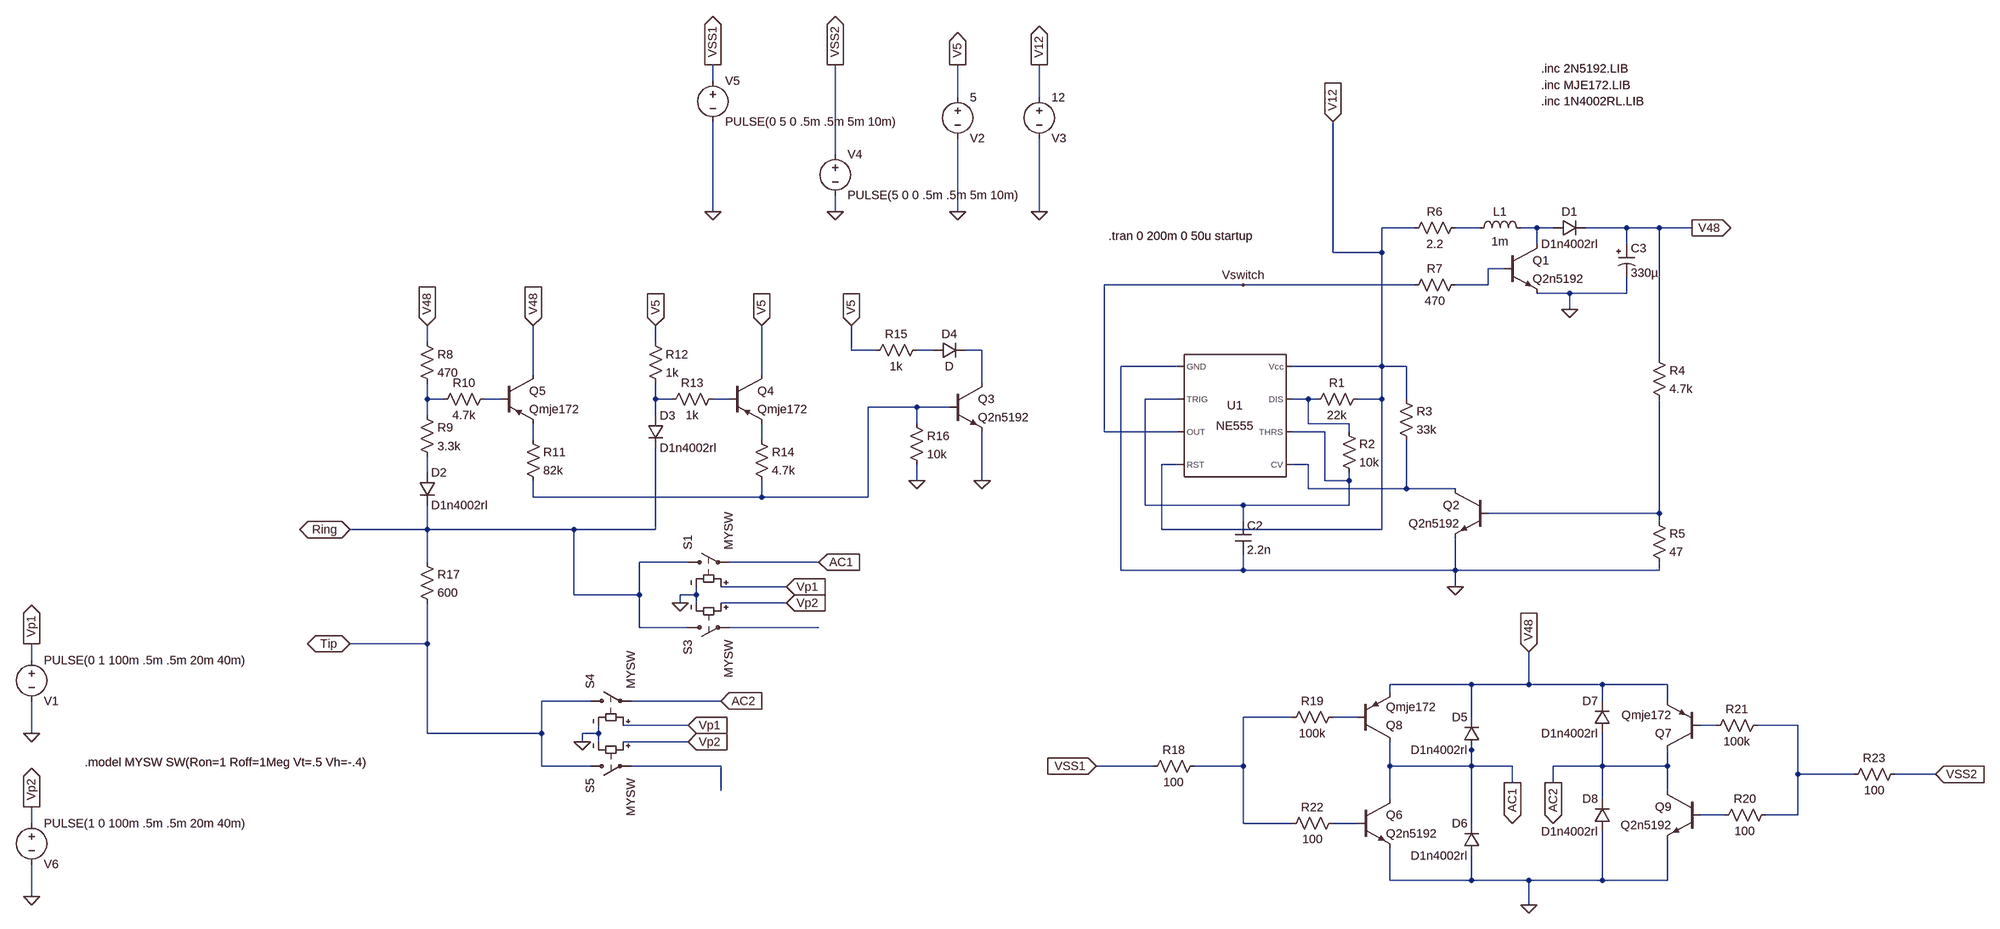
[diagram p0: schematic phone.asc]
phone.asc, the LTspice schematic file:
Version 4
SHEET 1 888 1604
WIRE -1776 -288 -1776 -320
WIRE -1296 -256 -1296 -320
WIRE -1136 -256 -1136 -320
WIRE -1536 -144 -1536 -320
WIRE -1776 -32 -1776 -208
WIRE -1536 -32 -1536 -64
WIRE -1296 -32 -1296 -176
WIRE -1136 -32 -1136 -176
WIRE -400 0 -464 0
WIRE -272 0 -320 0
WIRE -160 0 -192 0
WIRE -128 0 -160 0
WIRE 16 0 -64 0
WIRE 80 0 16 0
WIRE 144 0 80 0
WIRE -160 32 -160 0
WIRE 16 32 16 0
WIRE -560 48 -560 -208
WIRE -464 48 -464 0
WIRE -464 48 -560 48
WIRE -224 80 -256 80
WIRE -736 112 -1008 112
WIRE -400 112 -736 112
WIRE -256 112 -256 80
WIRE -256 112 -320 112
WIRE -96 128 -160 128
WIRE 16 128 16 96
WIRE 16 128 -96 128
WIRE -96 160 -96 128
WIRE -2336 224 -2336 192
WIRE -1888 224 -1888 192
WIRE -1504 240 -1504 192
WIRE -1456 240 -1504 240
WIRE -1344 240 -1376 240
WIRE -1248 240 -1280 240
WIRE 80 256 80 0
WIRE -864 272 -976 272
WIRE -464 272 -464 48
WIRE -464 272 -640 272
WIRE -416 272 -464 272
WIRE -2128 288 -2128 192
WIRE -1680 288 -1680 192
WIRE -1248 304 -1248 240
WIRE -2336 336 -2336 304
WIRE -2304 336 -2336 336
WIRE -2192 336 -2224 336
WIRE -1888 336 -1888 304
WIRE -1856 336 -1888 336
WIRE -1744 336 -1776 336
WIRE -864 336 -928 336
WIRE -608 336 -640 336
WIRE -592 336 -608 336
WIRE -464 336 -464 272
WIRE -464 336 -512 336
WIRE -416 336 -416 272
WIRE -1376 352 -1472 352
WIRE -1312 352 -1376 352
WIRE -2336 368 -2336 336
WIRE -1888 368 -1888 336
WIRE -1376 384 -1376 352
WIRE -608 384 -608 336
WIRE -528 384 -608 384
WIRE -1008 400 -1008 112
WIRE -864 400 -1008 400
WIRE -576 400 -640 400
WIRE -528 400 -528 384
WIRE -2128 416 -2128 384
WIRE -1680 416 -1680 384
WIRE -864 464 -896 464
WIRE -608 464 -640 464
WIRE -2336 480 -2336 448
WIRE -1376 496 -1376 464
WIRE -1248 496 -1248 400
WIRE -576 496 -576 400
WIRE -528 496 -528 480
WIRE -528 496 -576 496
WIRE -608 512 -608 464
WIRE -416 512 -416 416
WIRE -416 512 -608 512
WIRE -320 512 -416 512
WIRE -2128 528 -2128 496
WIRE -1680 528 -1680 496
WIRE -1680 528 -2128 528
WIRE -1472 528 -1472 352
WIRE -1472 528 -1680 528
WIRE -928 544 -928 336
WIRE -736 544 -928 544
WIRE -528 544 -528 496
WIRE -528 544 -736 544
WIRE 80 560 80 336
WIRE 80 560 -256 560
WIRE -736 576 -736 544
WIRE 80 576 80 560
WIRE -2336 592 -2336 544
WIRE -2336 592 -2576 592
WIRE -2048 592 -2336 592
WIRE -1888 592 -1888 432
WIRE -1888 592 -2048 592
WIRE -896 592 -896 464
WIRE -464 592 -464 336
WIRE -464 592 -896 592
WIRE -2336 656 -2336 592
WIRE -1824 656 -1920 656
WIRE -1568 656 -1744 656
WIRE -976 672 -976 272
WIRE -736 672 -736 640
WIRE -736 672 -976 672
WIRE -320 672 -320 608
WIRE -320 672 -736 672
WIRE 80 672 80 656
WIRE 80 672 -320 672
WIRE -1632 704 -1760 704
WIRE -320 704 -320 672
WIRE -2048 720 -2048 592
WIRE -1920 720 -1920 656
WIRE -1920 720 -2048 720
WIRE -1808 720 -1808 704
WIRE -1808 720 -1840 720
WIRE -1840 736 -1840 720
WIRE -1808 736 -1808 720
WIRE -1632 736 -1760 736
WIRE -1920 784 -1920 720
WIRE -1824 784 -1920 784
WIRE -1568 784 -1744 784
WIRE -2336 816 -2336 736
WIRE -2336 816 -2576 816
WIRE -3200 848 -3200 816
WIRE -288 896 -448 896
WIRE -176 896 -176 832
WIRE -176 896 -288 896
WIRE -32 896 -176 896
WIRE 96 896 -32 896
WIRE -448 912 -448 896
WIRE -2016 928 -2112 928
WIRE -1760 928 -1936 928
WIRE -32 928 -32 896
WIRE 96 928 96 896
WIRE -640 960 -736 960
WIRE -512 960 -560 960
WIRE -288 960 -288 896
WIRE -1824 976 -1952 976
WIRE 192 976 160 976
WIRE 352 976 272 976
WIRE -3200 992 -3200 928
WIRE -2336 992 -2336 816
WIRE -2112 992 -2112 928
WIRE -2112 992 -2336 992
WIRE -2000 992 -2000 976
WIRE -2000 992 -2032 992
WIRE -2032 1008 -2032 992
WIRE -2000 1008 -2000 992
WIRE -1824 1008 -1952 1008
WIRE -288 1024 -288 1008
WIRE -2112 1056 -2112 992
WIRE -2016 1056 -2112 1056
WIRE -1760 1056 -1936 1056
WIRE -912 1056 -1024 1056
WIRE -736 1056 -736 960
WIRE -736 1056 -832 1056
WIRE -448 1056 -448 1008
WIRE -288 1056 -288 1024
WIRE -288 1056 -448 1056
WIRE -208 1056 -288 1056
WIRE -32 1056 -32 992
WIRE -32 1056 -128 1056
WIRE 96 1056 96 1024
WIRE 96 1056 -32 1056
WIRE 352 1072 352 976
WIRE 480 1072 352 1072
WIRE 640 1072 560 1072
WIRE -208 1088 -208 1056
WIRE -128 1088 -128 1056
WIRE -1760 1104 -1760 1056
WIRE 96 1104 96 1056
WIRE -448 1120 -448 1056
WIRE -32 1120 -32 1056
WIRE 208 1152 160 1152
WIRE 352 1152 352 1072
WIRE 352 1152 288 1152
WIRE -3200 1168 -3200 1136
WIRE -736 1168 -736 1056
WIRE -640 1168 -736 1168
WIRE -512 1168 -560 1168
WIRE -288 1168 -288 1056
WIRE -448 1280 -448 1216
WIRE -288 1280 -288 1232
WIRE -288 1280 -448 1280
WIRE -176 1280 -288 1280
WIRE -32 1280 -32 1184
WIRE -32 1280 -176 1280
WIRE 96 1280 96 1200
WIRE 96 1280 -32 1280
WIRE -3200 1312 -3200 1248
WIRE -176 1328 -176 1280
FLAG -320 704 0
FLAG 144 0 V48
IOPIN 144 0 Out
FLAG -96 160 0
FLAG -736 112 Vswitch
FLAG -2128 192 V48
IOPIN -2128 192 In
FLAG -2336 192 V48
IOPIN -2336 192 In
FLAG -1888 192 V5
IOPIN -1888 192 In
FLAG -1680 192 V5
IOPIN -1680 192 In
FLAG -1504 192 V5
IOPIN -1504 192 In
FLAG -1376 496 0
FLAG -1248 496 0
FLAG -560 -208 V12
IOPIN -560 -208 In
FLAG -1136 -32 0
FLAG -1296 -32 0
FLAG -1296 -320 V5
IOPIN -1296 -320 Out
FLAG -1136 -320 V12
IOPIN -1136 -320 Out
FLAG -3200 992 0
FLAG -1536 -32 0
FLAG -1536 -320 VSS2
IOPIN -1536 -320 Out
FLAG -1776 -32 0
FLAG -1776 -320 VSS1
IOPIN -1776 -320 Out
FLAG -176 1328 0
FLAG -176 832 V48
IOPIN -176 832 In
FLAG -3200 816 Vp1
IOPIN -3200 816 Out
FLAG -208 1088 AC1
IOPIN -208 1088 Out
FLAG -128 1088 AC2
IOPIN -128 1088 Out
FLAG -1568 656 AC1
IOPIN -1568 656 In
FLAG -1760 928 AC2
IOPIN -1760 928 In
FLAG -1024 1056 VSS1
IOPIN -1024 1056 In
FLAG 640 1072 VSS2
IOPIN 640 1072 In
FLAG -2576 592 Ring
IOPIN -2576 592 BiDir
FLAG -2576 816 Tip
IOPIN -2576 816 BiDir
FLAG -1840 736 0
FLAG -1632 704 Vp1
IOPIN -1632 704 In
FLAG -2032 1008 0
FLAG -3200 1312 0
FLAG -3200 1136 Vp2
IOPIN -3200 1136 Out
FLAG -1632 736 Vp2
IOPIN -1632 736 In
FLAG -1824 976 Vp1
IOPIN -1824 976 In
FLAG -1824 1008 Vp2
IOPIN -1824 1008 In
SYMBOL Misc\\NE555 -752 368 R0
SYMATTR InstName U1
SYMBOL res -608 352 R270
WINDOW 0 32 56 VTop 2
WINDOW 3 0 56 VBottom 2
SYMATTR InstName R1
SYMATTR Value 22k
SYMBOL res -544 384 R0
SYMATTR InstName R2
SYMATTR Value 10k
SYMBOL res -432 320 R0
SYMATTR InstName R3
SYMATTR Value 33k
SYMBOL res 64 240 R0
SYMATTR InstName R4
SYMATTR Value 4.7k
SYMBOL res 64 560 R0
SYMATTR InstName R5
SYMATTR Value 47
SYMBOL res -416 16 R270
WINDOW 0 32 56 VTop 2
WINDOW 3 0 56 VBottom 2
SYMATTR InstName R6
SYMATTR Value 2.2
SYMBOL res -416 128 R270
WINDOW 0 32 56 VTop 2
WINDOW 3 0 56 VBottom 2
SYMATTR InstName R7
SYMATTR Value 470
SYMBOL npn -224 32 R0
SYMATTR InstName Q1
SYMATTR Value Q2n5192
SYMBOL npn -256 512 M0
SYMATTR InstName Q2
SYMATTR Value Q2n5192
SYMBOL cap -752 576 R0
SYMATTR InstName C2
SYMATTR Value 2.2n
SYMBOL diode -128 16 R270
WINDOW 0 32 32 VTop 2
WINDOW 3 0 32 VBottom 2
SYMATTR InstName D1
SYMATTR Value D1n4002rl
SYMBOL ind -288 16 R270
WINDOW 0 32 56 VTop 2
WINDOW 3 5 56 VBottom 2
SYMATTR InstName L1
SYMATTR Value 1m
SYMBOL res -2352 208 R0
SYMATTR InstName R8
SYMATTR Value 470
SYMBOL res -2352 352 R0
SYMATTR InstName R9
SYMATTR Value 3.3k
SYMBOL res -2208 320 R90
WINDOW 0 0 56 VBottom 2
WINDOW 3 32 56 VTop 2
SYMATTR InstName R10
SYMATTR Value 4.7k
SYMBOL res -2144 400 R0
SYMATTR InstName R11
SYMATTR Value 82k
SYMBOL res -1904 208 R0
SYMATTR InstName R12
SYMATTR Value 1k
SYMBOL res -1760 320 R90
WINDOW 0 0 56 VBottom 2
WINDOW 3 32 56 VTop 2
SYMATTR InstName R13
SYMATTR Value 1k
SYMBOL res -1696 400 R0
SYMATTR InstName R14
SYMATTR Value 4.7k
SYMBOL res -1360 224 R90
WINDOW 0 0 56 VBottom 2
WINDOW 3 32 56 VTop 2
SYMATTR InstName R15
SYMATTR Value 1k
SYMBOL res -1392 368 R0
SYMATTR InstName R16
SYMATTR Value 10k
SYMBOL npn -1312 304 R0
SYMATTR InstName Q3
SYMATTR Value Q2n5192
SYMBOL pnp -1744 288 R0
SYMATTR InstName Q4
SYMATTR Value Qmje172
SYMBOL pnp -2192 288 R0
SYMATTR InstName Q5
SYMATTR Value Qmje172
SYMBOL diode -2352 480 R0
SYMATTR InstName D2
SYMATTR Value D1n4002rl
SYMBOL diode -1904 368 R0
SYMATTR InstName D3
SYMATTR Value D1n4002rl
SYMBOL diode -1344 256 R270
WINDOW 0 32 32 VTop 2
WINDOW 3 0 32 VBottom 2
SYMATTR InstName D4
SYMBOL voltage -1296 -272 R0
WINDOW 0 24 96 Left 2
WINDOW 3 24 16 Left 2
WINDOW 123 0 0 Left 2
WINDOW 39 0 0 Left 2
SYMATTR InstName V2
SYMATTR Value 5
SYMBOL voltage -1136 -272 R0
WINDOW 0 24 96 Left 2
WINDOW 3 24 16 Left 2
WINDOW 123 0 0 Left 2
WINDOW 39 0 0 Left 2
SYMATTR InstName V3
SYMATTR Value 12
SYMBOL res -2352 640 R0
SYMATTR InstName R17
SYMATTR Value 600
SYMBOL voltage -3200 832 R0
WINDOW 0 24 96 Left 2
WINDOW 3 24 16 Left 2
WINDOW 123 0 0 Left 2
WINDOW 39 0 0 Left 2
SYMATTR InstName V1
SYMATTR Value PULSE(0 1 100m .5m .5m 20m 40m)
SYMBOL voltage -1536 -160 R0
WINDOW 123 0 0 Left 0
WINDOW 39 0 0 Left 0
SYMATTR InstName V4
SYMATTR Value PULSE(5 0 0 .5m .5m 5m 10m)
SYMBOL voltage -1776 -304 R0
WINDOW 123 0 0 Left 0
WINDOW 39 0 0 Left 0
SYMATTR InstName V5
SYMATTR Value PULSE(0 5 0 .5m .5m 5m 10m)
SYMBOL diode -272 1024 R180
WINDOW 0 24 64 Left 2
WINDOW 3 24 0 Left 2
SYMATTR InstName D5
SYMATTR Value D1n4002rl
SYMBOL diode -272 1232 R180
WINDOW 0 24 64 Left 2
WINDOW 3 24 0 Left 2
SYMATTR InstName D6
SYMATTR Value D1n4002rl
SYMBOL diode -16 992 R180
WINDOW 0 24 64 Left 2
WINDOW 3 24 0 Left 2
SYMATTR InstName D7
SYMATTR Value D1n4002rl
SYMBOL diode -16 1184 R180
WINDOW 0 24 64 Left 2
WINDOW 3 24 0 Left 2
SYMATTR InstName D8
SYMATTR Value D1n4002rl
SYMBOL res -544 944 R90
WINDOW 0 0 56 VBottom 2
WINDOW 3 32 56 VTop 2
SYMATTR InstName R19
SYMATTR Value 100k
SYMBOL res 304 1136 R90
WINDOW 0 0 56 VBottom 2
WINDOW 3 32 56 VTop 2
SYMATTR InstName R20
SYMATTR Value 100
SYMBOL res 288 960 R90
WINDOW 0 0 56 VBottom 2
WINDOW 3 32 56 VTop 2
SYMATTR InstName R21
SYMATTR Value 100k
SYMBOL res -544 1152 R90
WINDOW 0 0 56 VBottom 2
WINDOW 3 32 56 VTop 2
SYMATTR InstName R22
SYMATTR Value 100
SYMBOL npn -512 1120 R0
SYMATTR InstName Q6
SYMATTR Value Q2n5192
SYMBOL pnp 160 1024 R180
SYMATTR InstName Q7
SYMATTR Value Qmje172
SYMBOL pnp -512 1008 M180
SYMATTR InstName Q8
SYMATTR Value Qmje172
SYMBOL npn 160 1104 M0
SYMATTR InstName Q9
SYMATTR Value Q2n5192
SYMBOL polcap 0 32 R0
SYMATTR InstName C3
SYMATTR Value 330µ
SYMBOL res -816 1040 R90
WINDOW 0 0 56 VBottom 2
WINDOW 3 32 56 VTop 2
SYMATTR InstName R18
SYMATTR Value 100
SYMBOL res 576 1056 R90
WINDOW 0 0 56 VBottom 2
WINDOW 3 32 56 VTop 2
SYMATTR InstName R23
SYMATTR Value 100
SYMBOL sw -1840 656 R270
SYMATTR InstName S1
SYMATTR Value MYSW
SYMBOL sw -1840 784 M90
SYMATTR InstName S3
SYMATTR Value MYSW
SYMBOL sw -2032 928 R270
SYMATTR InstName S4
SYMATTR Value MYSW
SYMBOL sw -2032 1056 M90
SYMATTR InstName S5
SYMATTR Value MYSW
SYMBOL voltage -3200 1152 R0
WINDOW 0 24 96 Left 2
WINDOW 3 24 16 Left 2
WINDOW 123 0 0 Left 2
WINDOW 39 0 0 Left 2
SYMATTR InstName V6
SYMATTR Value PULSE(1 0 100m .5m .5m 20m 40m)
TEXT -152 -280 Left 2 !.inc MJE172.LIB
TEXT -1000 16 Left 2 !.tran 0 200m 0 50u startup
TEXT -152 -312 Left 2 !.inc 2N5192.LIB
TEXT -152 -248 Left 2 !.inc 1N4002RL.LIB
TEXT -3096 1048 Left 2 !.model MYSW SW(Ron=1 Roff=1Meg Vt=.5 Vh=-.4)

The netlist it stands for:
* phone.asc
XU1 0 N010 Vswitch V12 N015 N010 N011 V12 NE555  ; pins GND TRIG OUT RST CV THRS DIS Vcc
R1 N011 V12 22k
R2 N011 N010 10k
R3 V12 N015 33k
R4 V48 N017 4.7k
R5 N017 0 47
R6 V12 N001 2.2
R7 Vswitch N003 470
Q1 N002 N003 0 0 Q2n5192
Q2 N015 N017 0 0 Q2n5192
C2 N010 0 2.2n
D1 N002 V48 D1n4002rl
L1 N001 N002 1m
R8 V48 N006 470
R9 N006 N016 3.3k
R10 N007 N006 4.7k
R11 N013 N012 82k
R12 V5 N008 1k
R13 N009 N008 1k
R14 N014 N012 4.7k
R15 N004 V5 1k
R16 N012 0 10k
Q3 N005 N012 0 0 Q2n5192
Q4 V5 N009 N014 0 Qmje172
Q5 V48 N007 N013 0 Qmje172
D2 N016 Ring D1n4002rl
D3 N008 Ring D1n4002rl
D4 N004 N005 D
V2 V5 0 5
V3 V12 0 12
R17 Ring Tip 600
V1 Vp1 0 PULSE(0 1 100m .5m .5m 20m 40m)
V4 VSS2 0 PULSE(5 0 0 .5m .5m 5m 10m)
V5 VSS1 0 PULSE(0 5 0 .5m .5m 5m 10m)
D5 AC1 V48 D1n4002rl
D6 0 AC1 D1n4002rl
D7 AC2 V48 D1n4002rl
D8 0 AC2 D1n4002rl
R19 N020 N019 100k
R20 N022 N024 100
R21 N022 N021 100k
R22 N025 N019 100
Q6 AC1 N025 0 0 Q2n5192
Q7 AC2 N021 V48 0 Qmje172
Q8 AC1 N020 V48 0 Qmje172
Q9 AC2 N024 0 0 Q2n5192
C3 V48 0 330µ
R18 N019 VSS1 100
R23 VSS2 N022 100
S1 Ring AC1 Vp1 0 MYSW
S3 Ring N018 Vp2 0 MYSW
S4 Tip AC2 Vp1 0 MYSW
S5 Tip N023 Vp2 0 MYSW
V6 Vp2 0 PULSE(1 0 100m .5m .5m 20m 40m)
.model D D
.lib standard.dio
.model NPN NPN
.model PNP PNP
.lib standard.bjt
.inc MJE172.LIB
.tran 0 200m 0 50u startup
.inc 2N5192.LIB
.inc 1N4002RL.LIB
.model MYSW SW(Ron=1 Roff=1Meg Vt=.5 Vh=-.4)
.lib NE555.sub
.backanno
.end